# EAGLE design U8_zero_HM11_v1.1 (EAGLE 7.4.0)
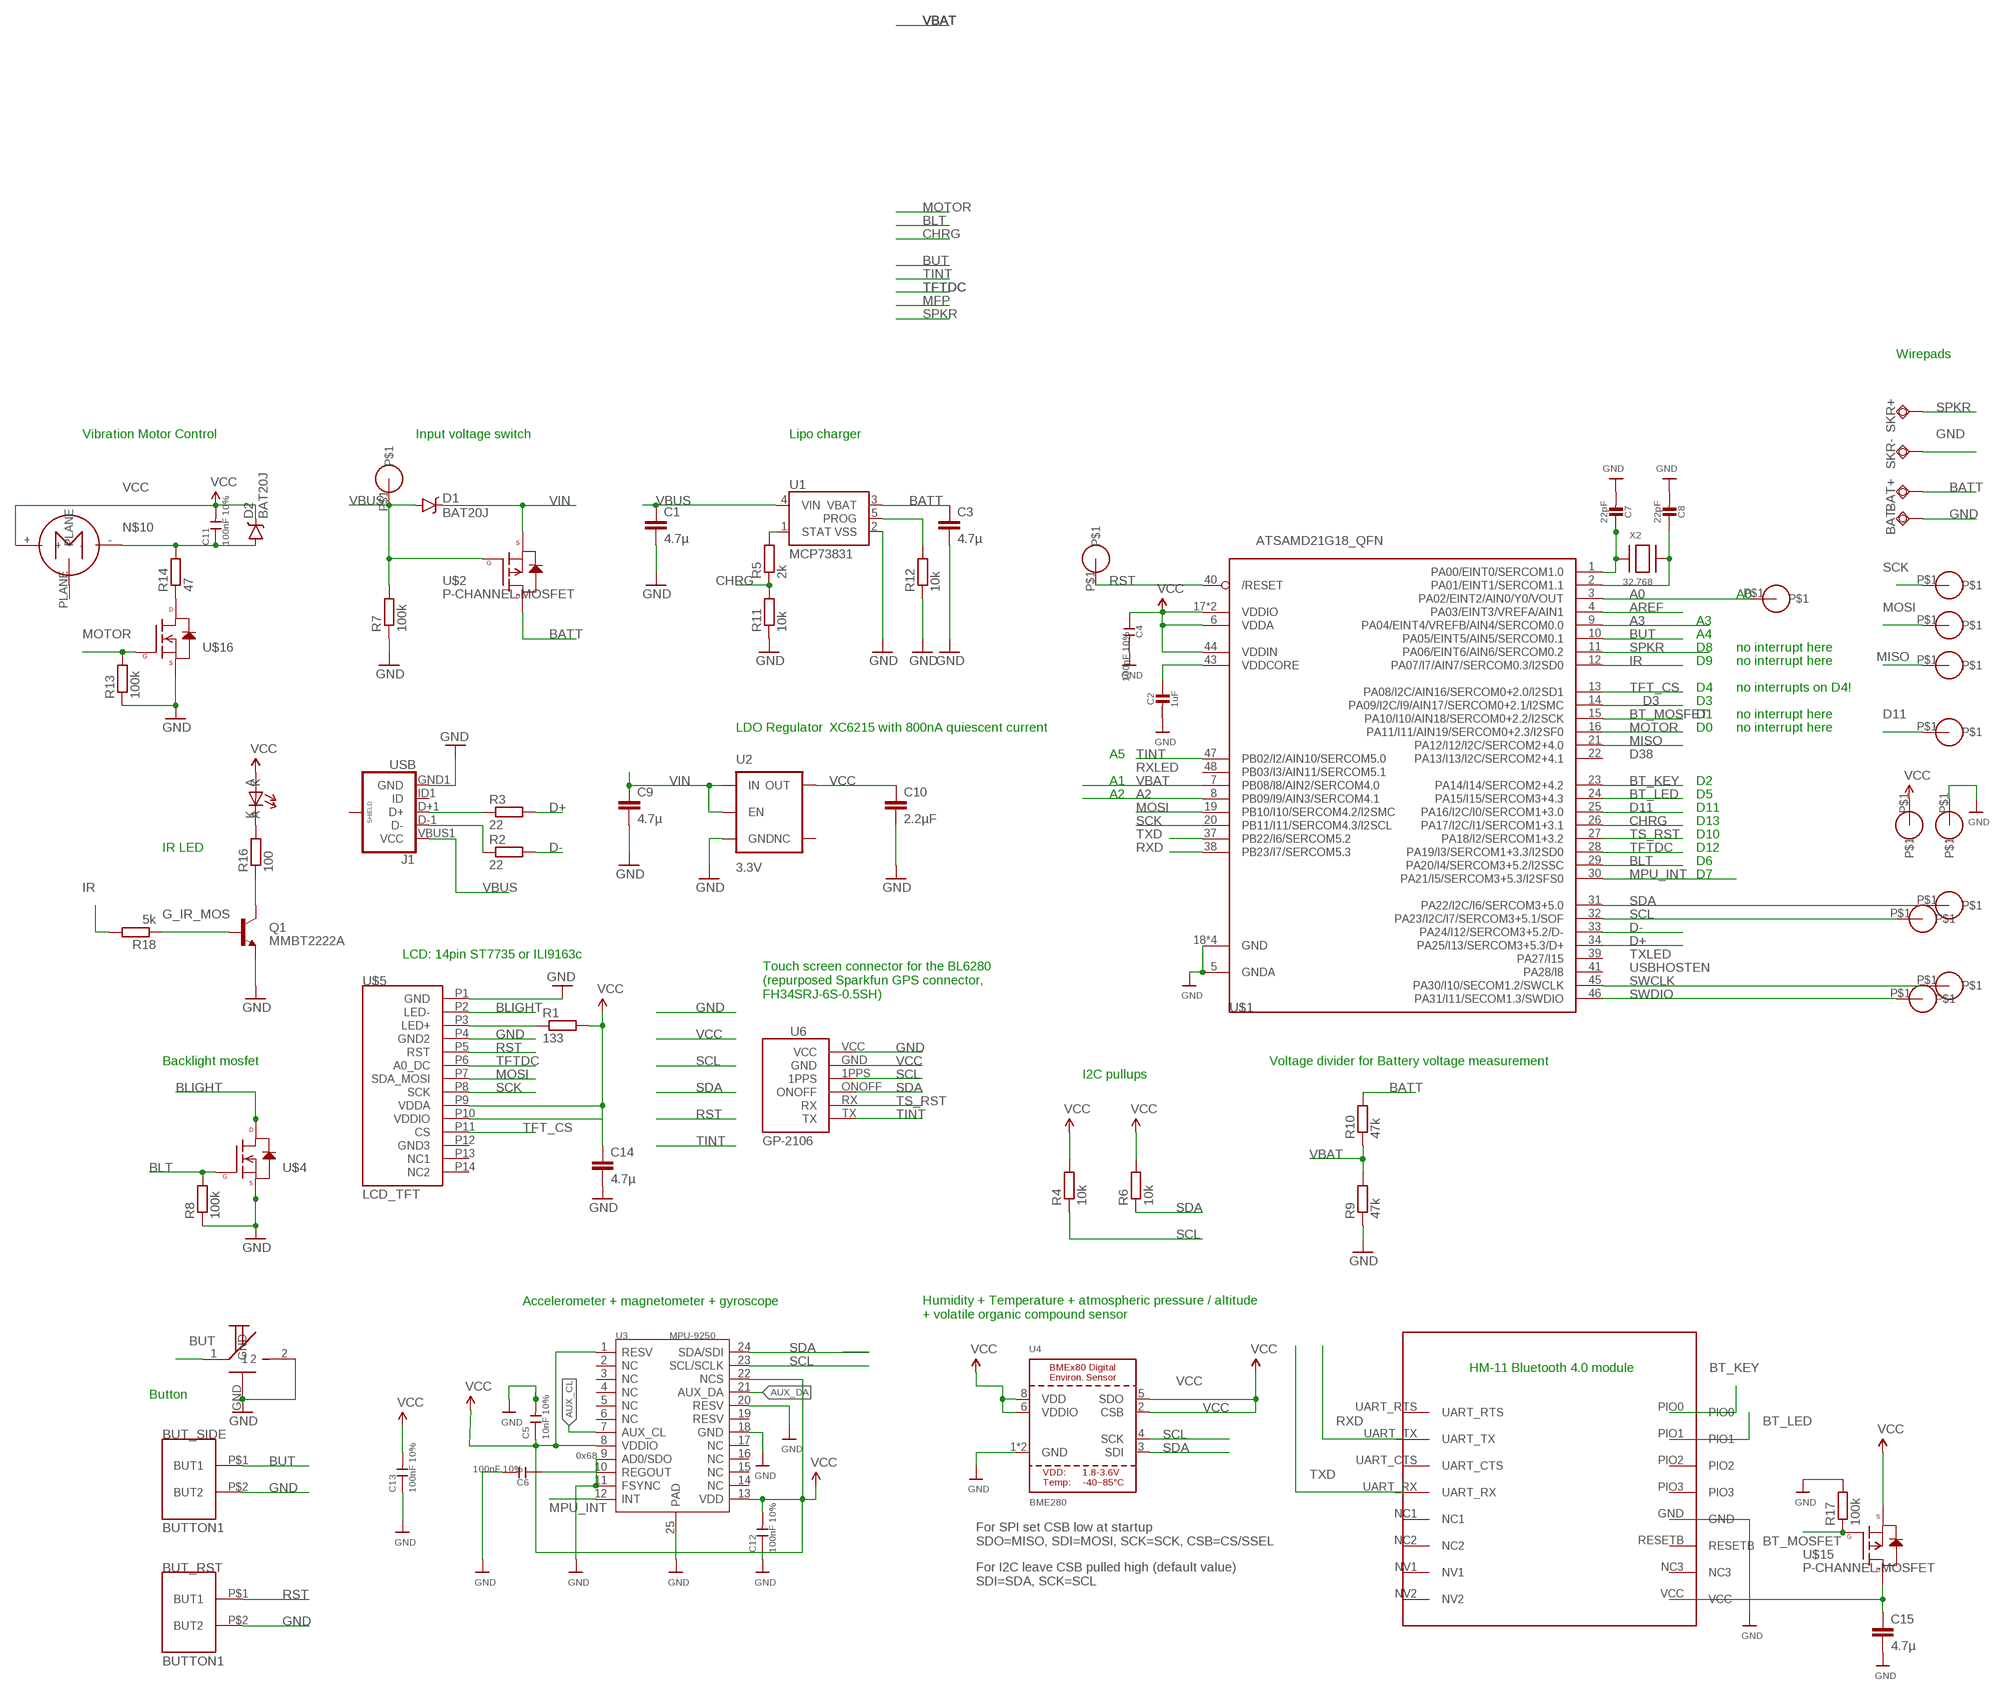
[diagram p0: schematic, sheet 1]

## Parts
BAT+  TPSQTP16R  [TP16R]
BAT-  TPSQTP16R  [TP16R]
BUT_RST  BUTTON1  [BUTTON1]
BUT_SIDE  BUTTON1  [BUTTON1]
C1  4.7µ  C-EUC0603  [C0603]
C2  1uF  CAP_CERAMIC0603_NO  [0603-NO]
C3  4.7µ  C-EUC0603  [C0603]
C4  100nF 10%  CAP-0603  [C0603]
C5  10nF 10%  CAP-0603  [C0603]
C6  100nF 10%  CAP-0603  [C0603]
C7  22pF  CAP_CERAMIC0603_NO  [0603-NO]
C8  22pF  CAP_CERAMIC0603_NO  [0603-NO]
C9  4.7µ  C-EUC0603  [C0603]
C10  2.2µF  C-EUC0603  [C0603]
C11  100nF 10%  CAP-0603  [C0603]
C12  100nF 10%  CAP-0603  [C0603]
C13  100nF 10%  CAP-0603  [C0603]
C14  4.7µ  C-EUC0603  [C0603]
C15  4.7µ  C-EUC0603  [C0603]
CLK  MINIPAD  [MINIPAD]
D1  BAT20J  DIODE-SCHOTTKY-BAT20J  [SOD-323]
D2  BAT20J  DIODE-SCHOTTKY-BAT20J  [SOD-323]
DIO  MINIPAD  [MINIPAD]
DIO1  MINIPAD  [MINIPAD]
DIO2  MINIPAD  [MINIPAD]
DIO3  MINIPAD  [MINIPAD]
DIO4  MINIPAD  [MINIPAD]
DIO5  MINIPAD  [MINIPAD]
J1  USB  USB_MICROB_PLUGCONN-11752  [USB-B-MICRO-SMD_V03]
Q1  MMBT2222A  TRANSISTOR_NPNMMBT2222A  [SOT23-3]
R1  133  R-EU_R0603  [R0603]
R2  22  R-EU_R0603  [R0603]
R3  22  R-EU_R0603  [R0603]
R4  10k  R-EU_R0603  [R0603]
R5  2k  R-EU_R0603  [R0603]
R6  10k  R-EU_R0603  [R0603]
R7  100k  R-EU_R0603  [R0603]
R8  100k  R-EU_R0603  [R0603]
R9  47k  R-EU_R0603  [R0603]
R10  47k  R-EU_R0603  [R0603]
R11  10k  R-EU_R0603  [R0603]
R12  10k  R-EU_R0603  [R0603]
R13  100k  R-EU_R0603  [R0603]
R14  47  R-EU_R0603  [R0603]
R16  100  R-EU_R0603  [R0603]
R17  100k  R-EU_R0603  [R0603]
R18  5k  R-EU_R0603  [R0603]
SKR+  TPSQTP12R  [TP12R]
SKR-  TPSQTP12R  [TP12R]
U1  MCP73831  [SOT23-5]
U2  3.3V  V_REG_AP2112K-3.3V  [SOT23-5]
U3  MPU-9250  [LEAD-QFN24]
U4  BME280  [BME280]
U6  GP-2106  [GP-2106]
U$1  ATSAMD21G18_QFN  ATSAMD21J_QFN  [TQFN48_7MM]
U$2  P-CHANNEL-MOSFET  [SOT23-3]
U$3  MINIPAD  [MINIPAD]
U$4  N-CHANNEL-MOSFET-BSS138  [SOT23-3]
U$5  LCD_TFT  [LCD_FPC14]
U$8  HM-11  [HM-11]
U$15  P-CHANNEL-MOSFET  [SOT23-3]
U$16  N-CHANNEL-MOSFET-BSS138  [SOT23-3]
U$18  MINIPAD  [MINIPAD]
U$20  MINIPAD  [MINIPAD]
U$21  MINIPAD  [MINIPAD]
U$22  B3U-3100P-B  [B3U-3100P-B]
U$23  VIBRO  [VIBRO]
U$24  APA3010F3C-GX  [APA3010F3C-GX]
U$41  MINIPAD  [MINIPAD]
U$42  MINIPAD  [MINIPAD]
X2  32.768  XTAL-3.2X1.5  [XTAL3215]

## Nets
A0: U$1.3(PA02/EINT2/AIN0/Y0/VOUT) U$20.P$1
A2: U$1.8(PB09/I9/AIN3/SERCOM4.1)
A3: U$1.9(PA04/EINT4/VREFB/AIN4/SERCOM0.0)
AREF: U$1.4(PA03/EINT3/VREFA/AIN1)
AUX_CL: U3.7(AUX_CL)
AUX_DA: U3.21(AUX_DA)
BATT: BAT+.TP C3.1 R10.2 U1.3(VBAT) U$2.3(D)
BLIGHT: U$4.3(D) U$5.P2(LED-)
BLT: R8.2 U$1.29(PA20/I4/SERCOM3+5.2/I2SSC) U$4.1(G)
BT_KEY: U$1.23(PA14/I14/SERCOM2+4.2) U$8.PIO0
BT_LED: U$1.24(PA15/I15/SERCOM3+4.3) U$8.PIO1
BT_MOSFET: R17.1 U$1.15(PA10/I10/AIN18/SERCOM0+2.2/I2SCK) U$15.1(G)
BUT: BUT_SIDE.P$1(BUT1) U$1.10(PA05/EINT5/AIN5/SERCOM0.1) U$22.1
CHRG: R5.1 R11.2 U$1.26(PA17/I2C/I1/SERCOM1+3.1)
D3: U$1.14(PA09/I2C/I9/AIN17/SERCOM0+2.1/I2SMC)
D11: DIO4.P$1 U$1.25(PA16/I2C/I0/SERCOM1+3.0)
D+: R3.2 U$1.34(PA25/I13/SERCOM3+5.3/D+)
D-: R2.2 U$1.33(PA24/I12/SERCOM3+5.2/D-)
G_IR_MOS: Q1.1(B) R18.1
GND: BAT-.TP BUT_RST.P$2(BUT2) BUT_SIDE.P$2(BUT2) C1.2 C2.2 C3.2 C4.2 C5.2 C6.2 C7.2 C8.2 C9.2 C10.2 C12.1 C13.1 C14.2 C15.2 J1.GND1(GND) Q1.2(E) R7.1 R8.1 R9.1 R11.1 R12.1 R13.1 R17.2 SKR-.TP U1.2(VSS) U2.2(GND) U3.9(AD0/SDO) U3.11(FSYNC) U3.18(GND) U3.20(RESV) U3.25(PAD) U4.1(GND) U4.7(GND) U6.VCC U$1.5(GNDA) U$1.18(GND) U$1.35(GND) U$1.42(GND) U$1.THERMAL(GND) U$4.2(S) U$5.P1(GND) U$5.P4(GND2) U$8.GND U$16.2(S) U$22.2 U$22.GND U$42.P$1
IR: R18.2 U$1.12(PA07/I7/AIN7/SERCOM0.3/I2SD0)
MISO: DIO1.P$1 U$1.21(PA12/I12/I2C/SERCOM2+4.0)
MOSI: DIO2.P$1 U$1.19(PB10/I10/SERCOM4.2/I2SMC) U$5.P7(SDA_MOSI)
MOTOR: R13.2 U$1.16(PA11/I11/AIN19/SERCOM0+2.3/I2SF0) U$16.1(G)
MPU_INT: U3.12(INT) U$1.30(PA21/I5/SERCOM3+5.3/I2SFS0)
N$1: C6.1 U3.10(REGOUT)
N$2: C7.1 U$1.1(PA00/EINT0/SERCOM1.0) X2.P$1
N$3: C8.1 U$1.2(PA01/EINT1/SERCOM1.1) X2.P$2
N$4: R14.1 U$16.3(D)
N$5: J1.D+1(D+) R3.1
N$6: J1.D-1(D-) R2.1
N$7: R12.2 U1.5(PROG)
N$8: R5.2 U1.1(STAT)
N$9: R1.1 U$5.P3(LED+)
N$10: C11.1 D2.A R14.2 U$23.-
N$12: Q1.3(C) R16.1
N$13: R16.2 U$24.K
N$15: C15.1 U$8.VCC U$15.3(D)
PLANE: U$23.PLANE
RST: BUT_RST.P$1(BUT1) U$1.40(/RESET) U$3.P$1 U$5.P5(RST)
RXD: U$1.38(PB23/I7/SERCOM5.3) U$8.UART_TX
SCK: DIO3.P$1 U$1.20(PB11/I11/SERCOM4.3/I2SCL) U$5.P8(SCK)
SCL: R4.1 U3.23(SCL/SCLK) U4.4(SCK) U6.1PPS U$1.32(PA23/I2C/I7/SERCOM3+5.1/SOF) U$21.P$1
SDA: R6.1 U3.24(SDA/SDI) U4.3(SDI) U6.ONOFF U$1.31(PA22/I2C/I6/SERCOM3+5.0) U$18.P$1
SPKR: SKR+.TP U$1.11(PA06/EINT6/AIN6/SERCOM0.2)
SWCLK: CLK.P$1 U$1.45(PA30/I10/SECOM1.2/SWCLK)
SWDIO: DIO.P$1 U$1.46(PA31/I11/SECOM1.3/SWDIO)
TFT_CS: U$1.13(PA08/I2C/AIN16/SERCOM0+2.0/I2SD1) U$5.P11(CS)
TFTDC: U$1.28(PA19/I3/SERCOM1+3.3/I2SD0) U$5.P6(A0_DC)
TINT: U6.TX U$1.47(PB02/I2/AIN10/SERCOM5.0)
TS_RST: U6.RX U$1.27(PA18/I2/SERCOM1+3.2)
TXD: U$1.37(PB22/I6/SERCOM5.2) U$8.UART_RX
VBAT: R9.2 R10.1 U$1.7(PB08/I8/AIN2/SERCOM4.0)
VBUS: C1.1 D1.A DIO5.P$1 J1.VBUS1(VCC) R7.2 U1.4(VIN) U$2.1(G)
VCC: C4.1 C5.1 C10.1 C11.2 C12.2 C13.2 C14.1 D2.C R1.2 R4.2 R6.2 U2.5(OUT) U3.1(RESV) U3.8(VDDIO) U3.13(VDD) U3.22(NCS) U4.2(CSB) U4.5(SDO) U4.6(VDDIO) U4.8(VDD) U6.GND U$1.6(VDDA) U$1.17(VDDIO) U$1.36(VDDIO) U$1.44(VDDIN) U$5.P9(VDDA) U$5.P10(VDDIO) U$15.2(S) U$23.+ U$24.A U$41.P$1
VDDCORE1: C2.1 U$1.43(VDDCORE)
VIN: C9.1 D1.C U2.1(IN) U2.3(EN) U$2.2(S)
Unconnected: J1.ID1(ID) J1.SHIELD1(SHIELD) J1.SHIELD2(SHIELD) J1.SHIELD3(SHIELD) U2.4(NC) U3.2(NC) U3.3(NC) U3.4(NC) U3.5(NC) U3.6(NC) U3.14(NC) U3.15(NC) U3.16(NC) U3.17(NC) U3.19(RESV) U$1.22(PA13/I13/I2C/SERCOM2+4.1) U$1.39(PA27/I15) U$1.41(PA28/I8) U$1.48(PB03/I3/AIN11/SERCOM5.1) U$5.P12(GND3) U$5.P13(NC1) U$5.P14(NC2) U$8.NC1 U$8.NC2 U$8.NC3 U$8.NV1 U$8.NV2 U$8.PIO2 U$8.PIO3 U$8.RESETB U$8.UART_CTS U$8.UART_RTS

## Notes on the sheet
- Wirepads
- Vibration Motor Control | Input voltage switch | Lipo charger
- A0
- A3
- A4
- D8 | no interrupt here
- D9 | no interrupt here
- D4 | no interrupts on D4!
- D3
- D1 | no interrupt here
- LDO Regulator | XC6215 with 800nA quiescent current | D0 | no interrupt here
- A5 | D38
- RXLED
- A1 | D2
- A2 | D5
- D11
- D13
- TXD | D10
- IR LED | RXD | D12
- D6
- D7
- LCD: 14pin ST7735 or ILI9163c | TXLED
- USBHOSTEN
- Touch screen connector for the BL6280
  (repurposed Sparkfun GPS connector, 
  FH34SRJ-6S-0.5SH)
- Backlight mosfet | Voltage divider for Battery voltage measurement
- I2C pullups
- Accelerometer + magnetometer + gyroscope
- Humidity + Temperature + atmospheric pressure / altitude 
  + volatile organic compound sensor
- HM-11 Bluetooth 4.0 module
- Button
- 0x68
- For SPI set CSB low at startup
  SDO=MISO, SDI=MOSI, SCK=SCK, CSB=CS/SSEL
- For I2C leave CSB pulled high (default value)
  SDI=SDA, SCK=SCL

## Library data of the parts
BAT+ BAT- SKR+ SKR- = testpad:TPSQ: Test pad
BUT_RST BUT_SIDE = ard_watch:BUTTON1
C1 C3 C9 C10 C14 C15 = rcl:C-EU: CAPACITOR, European symbol
C2 C7 C8 = microbuilder:CAP_CERAMIC: Ceramic Capacitors For new designs, use the packages preceded by an '_' character since they are more reliable: The following footprints should be used on most boards: _0402 - Standard footprint for regular board layouts _0603 - Standard footprint for regular board layouts _0805 - Standard footprint for regular board layouts _1206 - Standard footprint for regular board layouts For extremely tight-pitch boards where space is at a premium, the following 'micro-pitch' footprints can be used (smaller pads, no silkscreen outline, etc.): _0402MP - Micro-pitch footprint for very dense/compact boards _0603MP - Micro-pitch footprint for very dense/compact boards _0805MP - Micro-pitch footprint for very dense/compact boards _1206MP - Micro-pitch footprint for very dense/compact boards
C4-C6 C11-C13 = Discrete-new:CAP: Ceramic Capacitors
CLK DIO DIO1-DIO5 U$3 U$18 U$20 U$21 U$41 U$42 = minipad:MINIPAD
D1 D2 = SparkFun-DiscreteSemi:DIODE-SCHOTTKY: Schottky diodes in SFE's production catalog BAT20J 1A 23V 0.62Vf RB751 120mA 40V 0.37Vf PMEG4005EJ 0.5A 40V 0.42Vf MBRA140 1A 40V 0.5Vf B340A 3A 40V SMA; PROD_ID: DIO-11623
J1 = SparkFun-Connectors:USB_MICROB_PLUG: USB Micro-B connectors Some male, some female. Watch your step!; PROD_ID: CONN-11752
Q1 = SparkFun-DiscreteSemi:TRANSISTOR_NPN: Generic NPN BJT MMBT2222A - TRANS-08049 (SOT-23, 1A 40V) MPSA42 - TRANS-09116 (SOT-23, 500mA 300V) MMBT5088LT1G - TRANS-11160 (SOT-23, 50 mA 30V) BC547 - COM-08928 <http://www.sparkfun.com/products/8928> (TO-92 45V 100mA) (1.Collector 2.Base 3.Emitter) 2N3904 - COM-00521 <http://www.sparkfun.com/products/521> (TO-92 40V 200mA) (1.Emitter 2.Base 3.Collector) P2N2222A - COM-12852 <http://www.sparkfun.com/products/12852> (TO-92 40V 600mA) (1.Collector 2.Base 3.Emitter); PROD_ID: TRANS-08049
R1-R14 R16-R18 = rcl:R-EU_: RESISTOR, European symbol
U1 = SparkFun-PowerIC:MCP73831: Miniature single cell, fully integrated Li-Ion, Li-polymer charge management controller http://ww1.microchip.com/downloads/en/DeviceDoc/20001984g.pdf IC-09995; PROD_ID: IC-09995
U2 = SparkFun-PowerIC:V_REG_AP2112: AP2112 - 600mA CMOS LDO Regulator w/ Enable The AP2112 is CMOS process low dropout linear regulator with enable function, the regulator delivers a guaranteed 600mA (min.) continuous load current. Features Output Voltage Accuracy: ±1.5% Output Current: 600mA (Min.) Foldback Short Current Protection: 50mA Enable Function to Turn ON/OFF VOUT Low Dropout Voltage (3.3V): 250mV (Typ.) @IOUT=600mA Excellent Load Regulation: 0.2%/A (Typ.) Excellent Line Regulation: 0.02%/V (Typ.) Low Quiescent Current: 55μA (Typ.) Low Standby Current: 0.01μA (Typ.) Low Output Noise: 50μVRMS PSRR: 100Hz -65dB, 1kHz -65dB OTSD Protection Stable with 1.0μF Flexible Cap: Ceramic, Tantalum and Aluminum Electrolytic Operation Temperature Range: -40°C to 85°C ESD: MM 400V, HBM 4000V; PROD_ID: VREG-12457
U3 = template:MPU-9250
U4 = microbuilder:BME280: BME280 - Environmental Sensor (I2C + SPI)
U6 = SparkFun:GP-2106: GP-2106 GPS SiRF IV
U$1 = microbuilder:ATSAMD21J
U$2 U$15 = GeekAmmo:P-CHANNEL-MOSFET: P-Channel MOSFET Mode Field Effect Transistor
U$4 U$16 = GeekAmmo:N-CHANNEL-MOSFET: N-Channel MOSFET Mode Field Effect Transistor; DATASHEET: http://www.fairchildsemi.com/ds/BS/BSS138.pdf; DIGIKEY: BSS138TR-ND; ELEMENT14: 2323154; URL: http://au.element14.com/fairchild-semiconductor/bss138/mosfet-n-ch-50v-220ma-sot-23/dp/2323154
U$5 = ard_watch:LCD_TFT
U$8 = HM-11:HM-11
U$22 = B3U-3100P-B:B3U-3100P-B
U$23 = vibro:VIBRO
U$24 = APA3010F3C-GX:APA3010F3C-GX
X2 = adafruit2:XTAL: Low cost SMT crystals, no capacitors included http://www.ladyada.net/library/eagle

## Net classes
4 USBpair: width 0.102 mm, drill 0.1 mm, clearance 0.15 mm to class 3

## Board
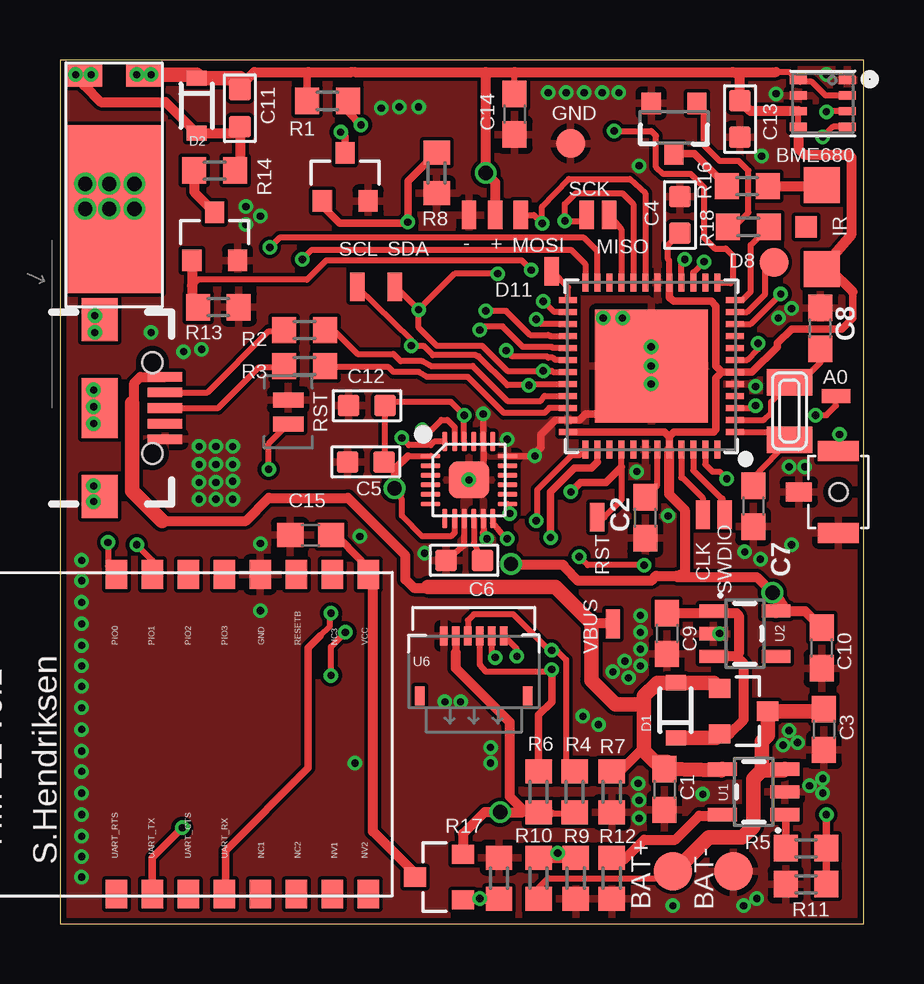
[diagram p1: board, top side]
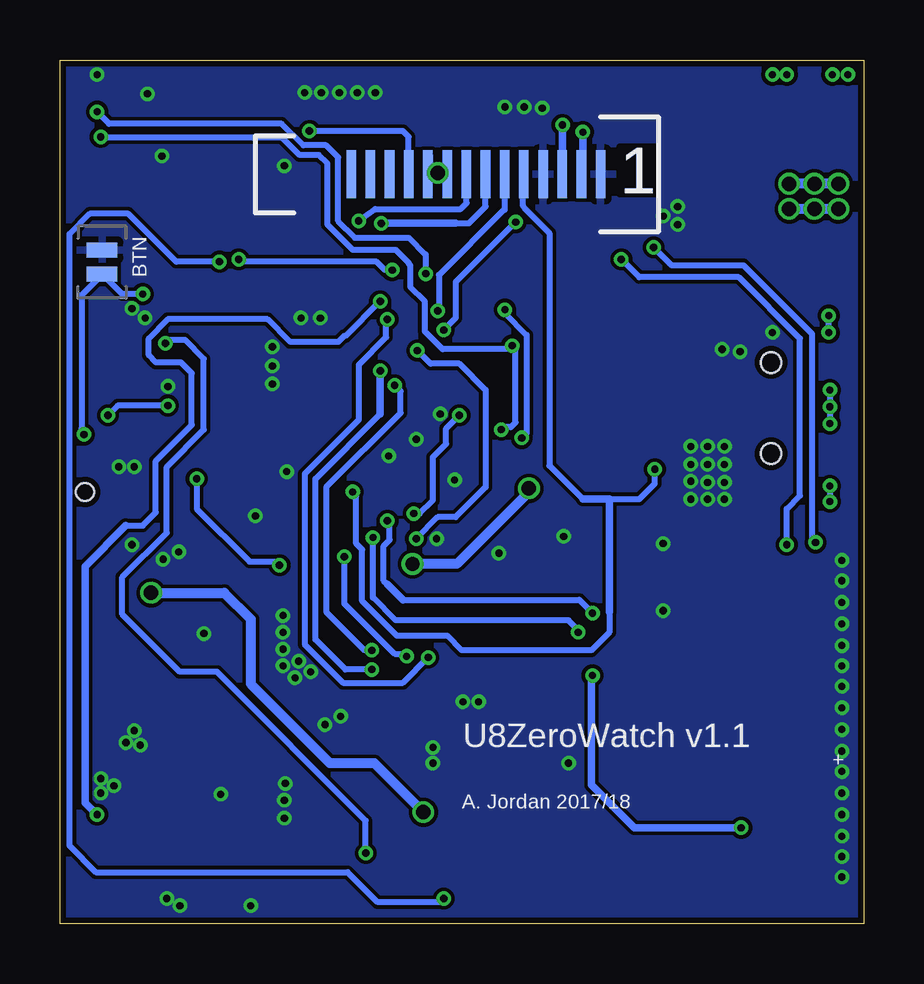
[diagram p2: board, bottom side, seen from below]

Size 33.5 x 36 mm. Coordinates in mm from the lower left corner, seen from the top.
Outline: 33.5,0 33.5,36 0,36 0,0 33.5,0
Copper layers (1*16): Top 0.035mm / dielectric 1.5mm / Bottom 0.035mm
Design rules "SeeedStudio_2layer_DRU_no_angle_20140221": minimum track width 6mil, minimum drill 12mil, track to track 6mil, track to pad 6mil, pad to pad 6mil, via to via 6mil, smd to smd 0mil, copper to edge 10mil, drill to drill 10mil, minimum pad ring 10mil, minimum via ring 6mil, stop-mask expansion 2mil, vias tented up to drill 100mil, thermal gap 10mil

### Footprints (pad centres in the part's own frame; a part is rotated, then mirrored left to right if it is on the bottom)
TP16R = smd 1.6 x 1.6: TP 0,0
BUTTON1 = smd 1.27 x 0.635: P$1 0,0.5; P$2 0,-0.5
C0603 = smd 1.1 x 1: 1 -0.85,0; 2 0.85,0
0603-NO = smd 1.1 x 1: 1 -0.85,0; 2 0.85,0
C0603' = smd 0.889 x 0.889: 1 0,0.762; 2 0,-0.762
MINIPAD = smd 1.2 x 0.6: P$1 0,0
SOD-323 = smd 0.63 x 0.83: A 1.15,0; C -1.15,0
USB-B-MICRO-SMD_V03 = smd 1.45 x 0.4: D+1 2.725,0; D-1 2.725,0.65; GND1 2.725,-1.3; ID1 2.725,-0.65; VBUS1 2.725,1.3 | smd 1.5 x 1.8: SHIELD1 0,3.685; SHIELD2 0,-3.685 | smd 1.5 x 2.5: SHIELD3 0,0 | hole 0.85: 2.2,1.9; 2.2,-1.9
SOT23-3 = smd 0.8 x 0.9: 1 -0.95,-1; 2 0.95,-1; 3 0,1.1
R0603 = smd 1 x 1.1: 1 -0.85,0; 2 0.85,0
TP12R = smd 1.2 x 1.2: TP 0,0
SOT23-5 = smd 0.55 x 1.2: 1 -0.95,-1.3; 2 0,-1.3; 3 0.95,-1.3; 4 0.95,1.3; 5 -0.95,1.3
LEAD-QFN24 = smd 0.8 x 0.2: 1 -1.6,1; 2 -1.6,0.6; 3 -1.6,0.2; 4 -1.6,-0.2; 5 -1.6,-0.6; 6 -1.6,-1; 13 1.6,-1; 14 1.6,-0.6; 15 1.6,-0.2; 16 1.6,0.2; 17 1.6,0.6; 18 1.6,1 | smd 0.2 x 0.8: 7 -1,-1.6; 8 -0.6,-1.6; 9 -0.2,-1.6; 10 0.2,-1.6; 11 0.6,-1.6; 12 1,-1.6; 19 1,1.6; 20 0.6,1.6; 21 0.2,1.6; 22 -0.2,1.6; 23 -0.6,1.6; 24 -1,1.6 | smd 1.7 x 1.54: 25 0,0
BME280 = smd 0.7 x 0.35: 1 1.025,0.975; 2 1.025,0.325; 3 1.025,-0.325; 4 1.025,-0.975; 5 -1.025,-0.975; 6 -1.025,-0.325; 7 -1.025,0.325; 8 -1.025,0.975
GP-2106 = smd 0.3 x 0.8: 1PPS -0.25,0; GND -0.75,0; ONOFF 0.25,0; RX 0.75,0; TX 1.25,0; VCC -1.25,0 | smd 0.4 x 0.8: P$7 -2.25,-2.5; P$8 2.25,-2.5
TQFN48_7MM = smd 0.25 x 0.75: 1 -2.75,-3.475; 2 -2.25,-3.475; 3 -1.75,-3.475; 4 -1.25,-3.475; 5 -0.75,-3.475; 6 -0.25,-3.475; 7 0.25,-3.475; 8 0.75,-3.475; 9 1.25,-3.475; 10 1.75,-3.475; 11 2.25,-3.475; 12 2.75,-3.475; 25 2.75,3.475; 26 2.25,3.475; 27 1.75,3.475; 28 1.25,3.475; 29 0.75,3.475; 30 0.25,3.475; 31 -0.25,3.475; 32 -0.75,3.475; 33 -1.25,3.475; 34 -1.75,3.475; 35 -2.25,3.475; 36 -2.75,3.475 | smd 0.75 x 0.25: 13 3.475,-2.75; 14 3.475,-2.25; 15 3.475,-1.75; 16 3.475,-1.25; 17 3.475,-0.75; 18 3.475,-0.25; 19 3.475,0.25; 20 3.475,0.75; 21 3.475,1.25; 22 3.475,1.75; 23 3.475,2.25; 24 3.475,2.75; 37 -3.475,2.75; 38 -3.475,2.25; 39 -3.475,1.75; 40 -3.475,1.25; 41 -3.475,0.75; 42 -3.475,0.25; 43 -3.475,-0.25; 44 -3.475,-0.75; 45 -3.475,-1.25; 46 -3.475,-1.75; 47 -3.475,-2.25; 48 -3.475,-2.75 | smd 4.7 x 4.7: THERMAL 0,0
SOT23-3' = smd 0.8 x 0.9: 1 -0.95,-1; 2 0.95,-1; 3 0,1
LCD_FPC14 = smd 2 x 0.4: P1 0,6.4; P2 0,5.6; P3 0,4.8; P4 0,4; P5 0,3.2; P6 0,2.4; P7 0,1.6; P8 0,0.8; P9 0,0; P10 0,-0.8; P11 0,-1.6; P12 0,-2.4; P13 0,-3.2; P14 0,-4
HM-11 = smd 1.2 x 0.9: GND 7.508,-0.6; NC1 -5.808,-0.6; NC2 -5.808,-2.1; NC3 7.508,-3.6; NV1 -5.808,-3.6; NV2 -5.808,-5.1; PIO0 7.508,5.4; PIO1 7.508,3.9; PIO2 7.508,2.4; PIO3 7.508,0.9; RESETB 7.508,-2.1; UART_CTS -5.808,2.4; UART_RTS -5.808,5.4; UART_RX -5.808,0.9; UART_TX -5.808,3.9; VCC 7.508,-5.1
B3U-3100P-B = smd 0.835 x 1.7: 1 -1.7,0; 2 1.7,0 | smd 0.8 x 1.1: GND 0,-1.65 | hole 0.75: 0,0
VIBRO = smd 1 x 1.5: + -4.6,1.25; - -4.6,-1.25 | smd 7 x 4: PLANE 1,0
APA3010F3C-GX = smd 1.5 x 1.5: A 1.75,0; K -1.75,0 | smd 0.9 x 0.9: P$2 0,-0.65
XTAL3215 = smd 1.1 x 1.9: P$1 1.2,0; P$2 -1.2,0

### Placement (x,y rotation side)
BAT+  25.56,2.18 0 top
BAT-  28.08,2.18 0 top
BUT_RST  9.52,21.33 180 top
BUT_SIDE  31.74,27.58 180 bottom
C1  25.2,5.6 270 top
C2  24.4,16.93 270 top
C3  31.85,8.1 270 top
C4  100nF 10%  [C0603']  25.85,29.55 180 top
C5  10nF 10%  [C0603']  12.75,19.25 270 top
C6  100nF 10%  [C0603']  16.85,15.15 270 top
C7  28.9,17.41 270 top
C8  31.7,24.82 90 top
C9  25.3,12.1 270 top
C10  31.75,11.5 270 top
C11  100nF 10%  [C0603']  7.5,34 180 top
C12  100nF 10%  [C0603']  12.8,21.6 90 top
C13  100nF 10%  [C0603']  28.35,33.55 180 top
C14  18.95,33.75 270 top
C15  10.45,16.2 180 top
CLK  26.8,17.05 90 top
D1  25.67,8.9 90 top
D2  5.7,34.1 270 top
DIO  27.7,17.05 90 top
DIO1  22.9,29.55 90 top
DIO2  19.2,29.55 90 top
DIO3  21.95,29.55 90 top
DIO4  20.5,27.2 90 top
DIO5  23.05,12.5 90 top
J1  1.65,21.5 0 top
Q1  25.6,33.2 180 top
R1  11.15,34.3 180 top
R2  10.2,24.75 0 top
R3  10.2,23.25 0 top
R4  21.45,5.5 270 top
R5  31.1,3.15 180 top
R6  19.95,5.5 270 top
R7  23,5.5 90 top
R8  15.7,31.3 90 top
R9  21.5,1.9 90 top
R10  19.95,1.9 270 top
R11  31.1,1.65 0 top
R12  23,1.9 90 top
R13  6.6,25.7 180 top
R14  6.45,31.4 0 top
R16  28.65,30.75 0 top
R17  18.3,1.9 90 top
R18  28.7,29.05 0 top
SKR+  29.77,27.58 0 top
SKR-  21.29,32.53 0 top
U1  28.92,5.5 90 top
U2  28.55,12.09 270 top
U3  17.05,18.5 0 top
U4  31.8,34.2 0 top
U6  17.25,12 0 top
U$1  24.65,23.25 90 top
U$2  P-CHANNEL-MOSFET  [SOT23-3']  28.5,8.86 270 top
U$3  22.4,16.95 90 top
U$4  N-CHANNEL-MOSFET-BSS138  [SOT23-3']  11.89,31.13 0 top
U$5  17.36,31.24 270 bottom
U$8  7.75,7.05 90 top
U$15  P-CHANNEL-MOSFET  [SOT23-3']  15.8,1.95 90 top
U$16  N-CHANNEL-MOSFET-BSS138  [SOT23-3']  6.45,28.65 0 top
U$18  13.95,26.55 270 top
U$20  32.35,22 0 top
U$21  12.4,26.55 90 top
U$22  32.45,18 270 top
U$23  2.25,30.8 270 top
U$24  31.75,29.05 270 top
U$41  18.15,29.55 270 top
U$42  17.05,29.55 270 top
X2  30.41,21.37 270 top

### Tracks (layer width: path | path; a pad name or v marks a point on that pad's centre or on a via)
A0  (via drill 0.3)
  Top 0.254: U$1.3 28.9,21.5 v29,21.6 | v31.5,21.2 31.95,21.2 32.35,21.6 U$20.P$1
  Bottom 0.254: v29,21.6 31.1,21.6 v31.5,21.2
BATT
  Top 0.254: R10.2 19.95,1.5 20.35,1.9 25.28,1.9 BAT+.TP
  Top 0.61: BAT+.TP 25.63,2.18 27.05,3.6 28.45,3.6 28.9,4.05 28.9,6.05 29.25,6.4 | 29.25,6.4 30.17,6.4 U1.3 | 29.25,6.4 29.25,7.6 29.5,7.85 U$2.3 | U$2.3 29.5,8.95 | U$2.3 31.76,8.86 C3.1
BLIGHT  (via drill 0.3)
  Top 0.305: U$4.3 11.88,32.82 v11.7,33
  Bottom 0.305: v11.7,33 11.7,31.3 U$5.P2
BLT  (via drill 0.3)
  Top 0.254: U$1.29 20.55,24 20.5,24.05 19.3,24.05 18.45,24.9 17.65,24.9 v17.5,24.75
  Top 0.305: U$4.1 10.94,29.91 11.65,29.2 14.45,29.2 v14.5,29.25 14.5,30.95 R8.2
  Bottom 0.254: 17.25,25 v17.5,24.75 17,25.25 17,26.75 v14.5,29.25
BT_KEY  (via drill 0.3)
  Top 0.254: U$1.23 22.4,28.05 21.85,28.6 9.15,28.6 v8.75,28.2 | v2,15.9 2,14.91 U$8.PIO0
  Bottom 0.254: v8.75,28.2 8,27.45 5,27.45 2.15,24.6 2.15,16.05 v2,15.9
BT_LED  (via drill 0.3)
  Top 0.254: U$8.PIO1 3.85,15.15 v3.2,15.8 | U$1.24 21.9,27.5 21.3,28.1 16.9,28.1 16.4,28.1 10.5,28.1 v10.1,27.7
  Bottom 0.254: v3.2,15.8 3.2,17.3 2.65,17.85 2.65,24.4 5.2,26.95 9.35,26.95 v10.1,27.7
BT_MOSFET  (via drill 0.3)
  Top 0.254: U$1.15 26.4,27.15 v26.85,27.6
  Top 0.406: U$15.1 v17.5,1.05 18.25,1 R17.1
  Bottom 0.254: v26.85,27.6 28.65,27.6 30.65,29.6 32.25,29.6 33.1,28.75 33.1,3.25 32,2.15 21.5,2.15 20.25,0.9 17.55,0.9 v17.5,1.05
BUT  (via drill 0.3)
  Top 0.254: U$1.10 28.8,25 v30.05,26.25 | v32.5,20.4 32.5,19.75 U$22.1
  Bottom 0.254: v30.05,26.25 30.91,26.25 BUT_SIDE.P$1 31.95,26.87 31.95,26.85 32.6,26.2 32.6,20.65 v32.5,20.4
CHRG  (via drill 0.3)
  Top 0.254: U$1.26 20.6,25.5 v20.15,25.95
  Top 0.305: v31.95,4.55 R5.1 | 31.95,2.3 R5.1 | R11.2 R5.1
  Bottom 0.254: 30.75,16.6 30.05,16.6 29.5,17.15 29.5,19.3 28,20.8 28,22.95 28.45,23.4 29.5,23.4 29.8,23.7 29.8,24.4 29,25.2 24.85,25.2 23.9,24.25 21.9,24.25 21.65,24.5 21.6,24.5 v20.15,25.95
  Bottom 0.305: 30.75,16.6 32.45,14.9 32.45,5.05 v31.95,4.55
D11
  Top 0.254: U$1.25 21.18,26.52 DIO4.P$1
D+
  Top 0.254: U$1.34 20.4,21.5 20.2,21.3 18.5,21.3 17,22.8 15.3,22.8 14.95,23 13.9,23 13.7,23.2 11.1,23.2 R3.2
D-
  Top 0.254: U$1.33 20.2,22 20.05,21.8 18.65,21.8 17.2,23.25 15.45,23.25 15.1,23.45 14.2,23.45 13.9,23.75 12.4,23.75 11.4,24.75 R2.2
G_IR_MOS
  Top 0.254: R18.1 28.1,29.05 28.7,29.65 28.7,31.4 28.3,31.8 27.5,31.8 26.85,32.45 26.85,33.9 Q1.1
GND  (via drill 0.3)
  Top 0.254: U3.9 16.85,15.76 C6.2 | U3.11 17.65,16.3 | U3.18 19.7,19.5 | v17.8,16.05 17.8,16.15 17.75,16.2 | U3.25 17.65,19.1 U3.20 v17.65,21.25
  Top 0.305: U$1.THERMAL 22.65,21.25 21.9,21.25 21.65,21 U$1.35 20.65,21 20.05,20.4 20.05,19.85 19.7,19.5 | 17.65,16.3 17.75,16.2
  Top 0.406: U2.2 27.59,12.09 v27.5,12.1
  Bottom 0.254: U$5.P4 13.36,31.44 13.35,31.6
  other vias: 24.2,10.75 15.2,15.45 5.8,19.15 5.8,19.9 7.2,19.9 7.2,19.15 7.2,18.45 7.2,17.7 6.5,17.7 6.5,18.4 6.5,19.15 5.8,18.4 5.8,17.7 24.05,18.85 24.65,22.5 24.65,23.25 24.65,24.05 0.9,6.35 14.15,34.05 0.9,8.1 0.9,10.75 0.9,5.45 0.9,7.2 29.2,15.2 28.55,15.5 31.8,6.05 31.8,5.45 29.85,34.6 5.9,23.95 5.15,23.85 0.9,4.55 23.7,10.25 30.4,8.05 30.15,7.45 0.9,1.95 0.9,2.8 25.55,0.75 29.05,1.05 28.5,0.75 31.25,5.75 30.75,7.55 22.65,25.25 0.9,9 0.9,9.9 16.05,9.25 17.95,7.35 12.3,6.7 17.95,6.7 0.9,3.65 17.05,18.5 6.5,19.9 16.7,9.25 18.65,20.2 3.8,24.65 21.8,8.65 22.45,8.3 20.35,34.65 31.95,35.4 29.25,32 30.5,25.65 24.1,5.85 14.95,34.05 26.8,5.4 24.15,5.15 24.2,11.45 24.2,12.15 24.2,12.85 23.55,10.95 23.05,10.5 23.3,34.65 21.1,34.65 22.6,34.65 21.85,34.65 13.4,34 29.95,25.25 24.15,31.6 23.45,25.25 0.9,12.5 0.9,15.15 0.9,11.6 0.9,13.4 0.9,14.3 8.35,15.85 8.35,13.05 7.75,29.15 7.75,29.9 8.35,29.5 19.8,19.5 12.5,16.15 30.5,15.8 25.35,17 29,22.4 30.4,19.05 31.05,19.05 24.15,4.4
  pour Top: -4.15,38.35 35.45,38.15 35.5,-1.65 13.55,-1.6 13.5,-0.9 4.9,-1 4.95,-1.9 -4.05,-1.95
  pour Bottom: -2.6,-1.85 5,-1.85 13.6,-1.9 13.55,-0.9 34.2,-0.85 34.2,36.65 -2.05,36.65
IR
  Top 0.254: U$1.12 28.45,26 28.8,26.35 28.8,28.3 R18.2
MISO
  Top 0.254: U$1.21 23.4,28.95 DIO1.P$1
MOSI  (via drill 0.3)
  Top 0.254: U$1.19 24.4,30.45 23.75,31.05 21.2,31.05 20.1,29.9 v20.1,29.2 19.75,29.55 DIO2.P$1
  Bottom 0.254: 17,29.2 16.45,29.2 15.75,29.9 15.75,30.45
  Bottom 0.305: v20.1,29.2 17,29.2 | 15.75,30.45 15.75,31.48 U$5.P7
MOTOR  (via drill 0.3)
  Top 0.254: U$1.16 25.9,27.55 v26.05,27.7 | 5.5,26.6 5.75,26.85 10.3,26.85 11.1,27.65 19.25,27.65 v19.65,27.25
  Top 0.406: U$16.1 5.5,26.6 5.5,25.95 R13.2
  Bottom 0.254: v19.65,27.25 19.95,27.25 20.3,27.6 25.95,27.6 v26.05,27.7
MPU_INT  (via drill 0.3)
  Top 0.254: U$1.30 20.65,23.5 20.55,23.6 20.35,23.6 20.3,23.65 18.85,23.65 v18.6,23.9 | v18.65,16.05 18.6,16.05 18.05,16.7 U3.12
  Bottom 0.254: v18.65,16.05 17.75,16.95 17,16.95 15.75,18.2 15.75,22.25 16.85,23.35 18.05,23.35 v18.6,23.9
N$1
  Top 0.254: U3.10 17.25,15.86 C6.1
N$2
  Top 0.254: U$1.1 30.03,20.5 X2.P$1 28.9,18.61 C7.1
N$3
  Top 0.254: 30.9,22.13 X2.P$2 | X2.P$2 30.87,22.57 31.7,23.4 C8.1 | U$1.2 29.35,21 29.65,21.3 29.65,21.76 X2.P$2
N$4
  Top 0.406: R14.1 5.6,30.5 U$16.3
N$5
  Top 0.254: J1.D+1 6.6,21.5 8.3,23.2 9.3,23.2 R3.1
N$6
  Top 0.254: J1.D-1 6.15,22.15 8.7,24.7 9.3,24.7 R2.1
N$7
  Top 0.305: 27.52,4.45 U1.5
  Top 0.406: R12.2 23.55,2.7 24.35,3.5 25.65,3.5 26.65,4.5 27.57,4.5 U1.5
N$8
  Top 0.305: R5.2 30.25,4.52 U1.1
N$9  (via drill 0.3)
  Top 0.305: R1.1 12,33.85 v12.55,33.3
  Bottom 0.305: v12.55,33.3 U$5.P3
N$10  (via drill 0.3)
  Top 0.254: v0.65,35.4 U$23.- v1.3,35.4
  Top 0.406: U$23.- 1,34.95 1.7,34.25 4.4,34.25 D2.A 7.21,32.95 C11.1 7.5,31.6 R14.2
N$12
  Top 0.254: 27.85,30.8 R16.1
  Top 0.305: Q1.3 26.45,32.1 R16.1
N$13
  Top 0.406: R16.2 32.05,30.75 32.1,30.7 31.65,30.7 U$24.K
N$14  (via drill 0.3)
  Bottom 0.254: v1.45,24.65 v1.45,25.35
N$15
  Top 0.305: C15.1 11.5,16.2 12.55,15.15 12.55,14.86 U$8.VCC
  Top 0.406: U$15.3 14.8,2.1 13.05,3.85 13.05,14.36 U$8.VCC
N$16  (via drill 0.3)
  Bottom 0.254: v1.4,22.25 v1.4,21.55 v1.4,20.85
N$17  (via drill 0.3)
  Bottom 0.254: v1.4,18.25 v1.4,17.6
PLANE  (via drill 0.6)
  Top 0.406: v2.05,29.8 U$23.PLANE
  Bottom 0.406: v1.05,29.8 v2.05,29.8 v3.1,29.8
PLANE1  (via drill 0.6)
  Top 0.406: v2.05,30.85 2.25,30.85
  Bottom 0.406: v1.05,30.85 v2.05,30.85 v3.1,30.85
RST  (via drill 0.3)
  Top 0.254: U$1.40 23.4,19.05 23.4,17.65 22.7,16.95 U$3.P$1 | v8.7,18.95 8.7,20.01 BUT_RST.P$1
  Top 0.305: 23.4,19.05 22.75,18.4 21.7,18.4 v21.3,18
  Bottom 0.254: U$5.P5 14.15,31.63 14.15,30.45 14.1,30.65 14.2,30.55 14.2,29.95 14.1,29.8 13.1,28.8 13.1,19.1 11.7,17.7 | v21.3,18 21.15,17.85 21.15,15.85 20.9,15.6 20.9,13.45 19.45,12 17.35,12 16.75,11.4 11.35,11.4 10.6,12.15 10.6,13 | 10.6,17.7 9.35,17.7 8.7,18.35 v8.7,18.95
  Bottom 0.305: 11.7,17.7 10.6,17.7 10.6,13
RXD  (via drill 0.3)
  Top 0.254: 22.4,19.25 U$1.38 | v11.3,10.35 11.3,11.55 v11.9,12.15
  Top 0.305: v20.45,16.1 20.45,18 21.45,19 22.15,19 22.4,19.25 | U$8.UART_TX 3.85,2.75 v5.1,4
  Bottom 0.254: v20.45,16.1 20.45,13.6 19.5,12.65 12.3,12.65 11.9,12.25 v11.9,12.15
  Bottom 0.305: v5.1,4 9.55,4 11.35,5.8 11.35,10.3 v11.3,10.35
SCK  (via drill 0.3)
  Top 0.254: U$1.20 23.9,30 23.45,30.45 21.5,30.45 21.05,30 v21.05,29.3 21.75,29.3 DIO3.P$1
  Bottom 0.254: v21.05,29.3 20.35,29.8 16.8,29.8 16.55,30.05 U$5.P8
  Bottom 0.305: 16.55,31.78 U$5.P8
SCL  (via drill 0.3)
  Top 0.254: 19.65,22.5 U$1.32 | v19.55,22.45 18.65,22.45 17.45,23.65 17.4,23.65 17.35,23.7 15.55,23.7 15.15,24.1 v14.65,24.1 14.65,24.35 U$21.P$1 | U6.1PPS 17,12.65 17.25,12.9 18.9,12.9 20.4,11.4 v20.5,11.4 20.7,11.4 21.1,11 21.1,6.7 R4.1 | 21.05,6.55 R4.1 | U4.4 32.23,33.23 v31.8,32.8 | 21.2,6.6 R4.1 | v15.1,20.6 15.5,20.6 15.9,21 16.15,21 16.45,20.7 U3.23
  Top 0.305: v19.55,22.45 19.65,22.5
  Bottom 0.254: 14.5,23.95 14.5,20.9 14.7,20.7 15,20.7 v15.1,20.6 | 14.5,23.95 v14.65,24.1 | v31.8,32.8 24.25,32.8 23.5,32.05 22.7,32.05 22.35,31.7 22.35,29.15 21.3,28.1 19.5,28.1 18.95,27.55 18.95,27.5 18.9,27.45 18.9,26.55 18.3,25.95 18.3,24.7 17.55,23.95 14.5,23.95 | v20.5,11.4 20.8,11.4 22.4,13 22.4,18.2 19.3,21.3 19.3,22.2 v19.55,22.45
SDA  (via drill 0.3)
  Top 0.254: U$1.31 20.55,23 20.5,23.05 v20.15,23.05 18.65,23.05 17.6,24.1 15.7,24.1 14.95,24.85 v14.95,25.6 | 20.4,10.5 17.75,10.5 17.5,10.8 U6.ONOFF | U4.3 31.97,33.88 v31.95,33.85 | v18.25,27.1 16.45,27.1 v14.95,25.6 | U$18.P$1 13.9,26.65 v14.95,25.6 | U3.24 15.6,20.1 15.45,19.95 14.55,19.95 v14.25,20.25
  Top 0.305: 20.4,10.5 v20.5,10.6 | 20.55,10.55 v20.5,10.6 | R6.1 19.95,8.7 20.5,9.25 v20.5,10.6
  Bottom 0.254: v20.5,10.6 21.6,10.6 22.85,11.85 22.85,18.55 20.15,21.25 | v18.25,27.1 18.25,27.9 18.95,28.6 21.2,28.6 21.9,29.3 21.9,31.95 22.4,32.45 23.35,32.45 24.25,33.35 31.45,33.35 v31.95,33.85 | v14.95,25.6 14.95,25.45 14.05,24.55 14.05,20.45 v14.25,20.25
  Bottom 0.305: 20.15,21.25 v20.15,23.05
SPKR
  Top 0.254: U$1.11 28.65,25.5 29.4,26.25 29.4,27.21 SKR+.TP
SWCLK
  Top 0.254: U$1.45 25.9,18.6 25.95,18.6 26.8,17.75 CLK.P$1
  Top 0.305: 26.8,17.3 CLK.P$1
SWDIO
  Top 0.254: U$1.46 26.4,18.9 27.6,17.7
  Top 0.305: 27.6,17.7 27.6,17.2 DIO.P$1
TFT_CS  (via drill 0.3)
  Top 0.254: v23.1,33.05 24.65,33.05 24.85,32.85 24.85,31.55 25.15,31.25 26.3,31.25 26.85,30.7 26.85,28.6 27.3,28.15 27.75,28.15 28.05,27.85 28.05,26.8 27.95,26.7 27.43,26.7 U$1.13
  Bottom 0.254: U$5.P11 18.96,32.81 19.2,33.05 v23.1,33.05
TFTDC  (via drill 0.3)
  Top 0.254: U$1.28 20.45,24.5 20.35,24.55 19.6,24.55 18.6,25.55 v17.75,25.55
  Bottom 0.254: 14.95,31.58 14.95,29.75 15,29.75 17.7,27.05 17.7,25.65 v17.75,25.55
  Bottom 0.305: 14.95,31.58 U$5.P6
TINT  (via drill 0.3)
  Top 0.254: U$1.47 26.9,19.15 27.2,18.85 27.5,18.85 v27.8,18.55 | v19.05,11.15 19.05,11.45 U6.TX | v24.35,14.95 22,14.95 v21.65,15.3
  Bottom 0.254: v27.8,18.55 27.8,17.3 25.6,15.1 24.45,15.1 v24.35,14.95 | v21.65,15.3 21.65,13.35 19.55,11.25 19.15,11.25 v19.05,11.15
TS_RST  (via drill 0.3)
  Top 0.254: U$1.27 20.05,25 v19.85,25.2 | v18.15,11.1 18,11.25 U6.RX
  Bottom 0.254: v18.15,11.1 19.2,10.05 21.7,10.05 23.3,11.65 23.3,18.75 21.05,21 21.05,23.3 19.9,24.45 19.9,25.15 v19.85,25.2
TXD  (via drill 0.3)
  Top 0.254: U$1.37 21.68,19.55 21.35,19.55 19.9,18.1 19.9,16.85 v19.85,16.8 | 10.85,12 11.25,12.4 11.25,12.9 v11.3,12.95
  Top 0.305: 10.85,12 10.35,11.5 10.35,6.5 6.9,3.05 6.9,1.29 U$8.UART_RX
  Bottom 0.254: 19.2,13.5 11.85,13.5 v11.3,12.95 | 19.85,14.15 20,14.3 20,15.75 19.75,16 19.75,16.7 v19.85,16.8
  Bottom 0.305: 19.2,13.5 19.85,14.15
VBAT  (via drill 0.3)
  Top 0.254: U$1.7 28.65,23.5 29.1,23.95 v29.1,24.2
  Top 0.305: R9.2 20.95,2.75 v20.75,2.95
  Top 0.406: R10.1 R9.2
  Bottom 0.254: v20.75,2.95 20.75,4.3 26.95,10.5 28.5,10.5 30.9,12.9 30.9,14.45 29.05,16.3 29.05,19.05 27.5,20.6 27.5,23.55 28.3,24.35 28.95,24.35 v29.1,24.2
VBUS
  Top 0.406: 3,21.7 3.1,21.7 3.1,22.55 3.35,22.8 J1.VBUS1 | R7.2 23.35,6.35 24.35,7.35 | 15.35,14.05 15.3,14 14.75,14 14.4,14.35 14.4,15.35 12,17.75 8.7,17.75 7.75,16.8 4.25,16.8 | 22.15,12.55 23,12.55 DIO5.P$1
  Top 0.61: 15.35,14.05 20.65,14.05 22.15,12.55 22.15,10.15 23.15,9.15 24.15,9.15 24.35,8.95 | U1.4 27.57,6.4 C1.1 25.3,6.75 24.8,6.75 24.35,7.2 24.35,7.35 24.35,8.95 | U$2.1 27.26,10.05 D1.A 24.9,10.05 24.35,9.5 24.35,9.25 | 24.35,8.95 24.35,9.25 | 4.25,16.8 3,18.05 3,21.7 | 24.3,9.2 24.35,9.25
VCC  (via drill 0.3, 0.6)
  Top 0.254: U3.8 16.45,16.3 16.3,16.15 15.1,16.15 14.25,17 14.25,17.7 14.22,17.73 14.22,17.88 v13.95,18.15 | U$1.17 25.4,27.65 25.35,27.7 25.35,28.29 C4.1 | 20.5,4.6 21.2,4.6 R4.2 | U4.2 31.93,34.52 31.35,35.1 30.85,35.1 U4.8 30.72,35.17 30.4,35.5 29.85,35.5 | U4.5 U4.6 | C14.1 18.95,35.5 | v3.2,35.4 U$23.+ | 14.5,19.5 U3.1 | 13.35,19.49 13.56,19.49 C12.2 13.71,21.75 16.3,21.75 v16.85,21.2 U3.22 | U3.13 18.65,17.2 v18.75,17.1
  Top 0.305: 13.35,19.49 C5.1 13.95,19.01 | U$1.36 25.2,20.5 25.4,20.3 U$1.44 25.4,20.3 25.6,20.5 27.25,20.5 27.35,20.6 27.35,22.75 27.6,23 | 27.6,23 U$1.6 28.85,23 29.9,24.05 29.9,24.2 30.5,24.8 32.6,24.8 33.05,25.25 33.05,26.35 | 27.6,23 27.35,23.25 27.35,25.75 27.15,25.95 25.6,25.95 25.4,26.1 25.4,26.68 U$1.17 | 16.5,11.3 U6.GND | 20.5,4.6 R6.2 | v13.95,18.15 13.95,19.01 | 13.95,19.01 14.01,19.01 14.5,19.5 | 12.3,35.5 12.15,35.5 | R1.2 10.3,35.45 10.35,35.5
  Top 0.406: 16.5,11.3 16.5,10.65 18.75,8.4 18.75,5.3 19.35,4.7 | 19.35,4.7 19.9,4.7 R6.2 | U2.5 31.06,13.04 C10.1 | 7.5,34.9 8.1,35.5 10.35,35.5 12.15,35.5 | 12.3,35.5 17.75,35.5 | 17.75,35.5 18.95,35.5 28.05,35.5 | 28.05,35.5 29.85,35.5 | 33.05,26.35 32.1,27.3 U$24.A 33,28.75 33,31.95 32.9,32.05 31.05,32.05 30.8,32.3 30.8,33.2 U4.5 | 28.05,35.5 28.35,35.35 C13.2 28.79,33.88 U4.6 | 17.75,35.5 v17.75,31.3 18.15,30.9 U$41.P$1 | 19.35,4.7 19.3,4.65 v18.35,4.65 17.7,4.65 16.8,3.75 U$15.2 | v18.8,15 18.9,14.95 21,14.95 21,14.9 21.6,14.3 24.65,14.3 24.85,14.5 25.7,14.5 25.75,14.45 | 30.05,13.24 30.05,13.45 v29.7,13.8 29.05,14.45 26.2,14.45 | 25.75,14.45 26.2,14.45 | 25.75,14.45 25.85,14.55 | U$1.44 25.4,17.9 26.05,17.25 26.05,14.6 26.2,14.45
  Top 0.61: 30.05,13.24 U2.5 | U$23.+ v3.8,35.4 5.7,35.4 D2.C 7.5,35.25 C11.2 7.5,34.9
  Bottom 0.254: 18.15,31 U$5.P10 | v18.75,17.1 18.5,17.1 17.95,17.65 17.95,19.45 17.4,20 17.4,20.65 v16.85,21.2
  Bottom 0.305: 18.1,31.73 U$5.P10 U$5.P9 | 18.15,32 18.15,31.7 v17.75,31.3
  Bottom 0.406: 18.15,32 18.15,31 | v13.95,18.15 13.95,18 16.95,15 v18.8,15 | v29.7,13.8 26.65,13.8 25.55,12.7 25.55,10 22.25,6.7 20.4,6.7 v18.35,4.65
VDDCORE1
  Top 0.254: U$1.43 24.9,18.28 C2.1
VIN
  Top 0.406: U$2.2 27.91,7.91 28.5,8.5 28.5,10.85 28.2,11.15 | C9.1 27.16,12.95 | 27.16,12.95 U2.1 | 27.16,12.95 28.2,12.95 28.3,12.85 28.3,11.25 28.2,11.15 | 28.2,11.15 U2.3
  Top 0.61: D1.C 27.34,7.75 U$2.2

### Text on the board
tPlace: GND | BME680 | SCK | SCL | - | + | MISO | IR | SDA | MOSI | D8 | D11 | A0 | RST | RST | CLK | VBUS | SWDIO
bPlace: BTN | U8ZeroWatch v1.1 | + | A. Jordan 2017/18